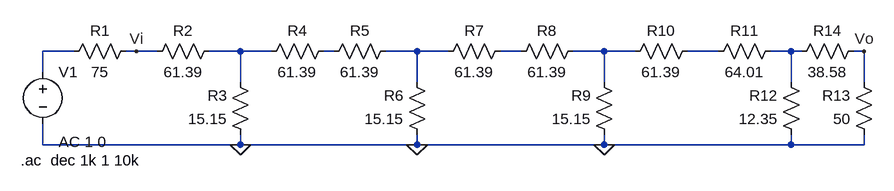
[diagram p0: schematic Circuito_P2d.asc]
Circuito_P2d.asc, the LTspice schematic file:
Version 4
SHEET 1 1264 680
WIRE 16 80 -32 80
WIRE 112 80 96 80
WIRE 144 80 112 80
WIRE 272 80 224 80
WIRE 320 80 272 80
WIRE 416 80 400 80
WIRE 544 80 496 80
WIRE 592 80 544 80
WIRE 704 80 672 80
WIRE 832 80 784 80
WIRE 880 80 832 80
WIRE 1008 80 960 80
WIRE 1120 80 1088 80
WIRE 1136 80 1120 80
WIRE 1232 80 1216 80
WIRE -32 112 -32 80
WIRE 272 128 272 80
WIRE 544 128 544 80
WIRE 832 128 832 80
WIRE 1120 128 1120 80
WIRE 1232 128 1232 80
WIRE -32 224 -32 192
WIRE 272 224 272 208
WIRE 272 224 -32 224
WIRE 544 224 544 208
WIRE 544 224 272 224
WIRE 832 224 832 208
WIRE 832 224 544 224
WIRE 1120 224 1120 208
WIRE 1120 224 832 224
WIRE 1232 224 1232 208
WIRE 1232 224 1120 224
FLAG 272 224 0
FLAG 544 224 0
FLAG 832 224 0
FLAG 112 80 Vi
FLAG 1232 80 Vo
SYMBOL voltage -32 96 R0
WINDOW 123 24 124 Left 2
WINDOW 39 0 0 Left 0
SYMATTR InstName V1
SYMATTR Value ""
SYMATTR Value2 AC 1 0
SYMBOL res 112 64 R90
WINDOW 0 0 56 VBottom 2
WINDOW 3 32 56 VTop 2
SYMATTR InstName R1
SYMATTR Value 75
SYMBOL res 240 64 R90
WINDOW 0 0 56 VBottom 2
WINDOW 3 32 56 VTop 2
SYMATTR InstName R2
SYMATTR Value 61.39
SYMBOL res 288 224 R180
WINDOW 0 36 76 Left 2
WINDOW 3 36 40 Left 2
SYMATTR InstName R3
SYMATTR Value 15.15
SYMBOL res 304 96 R270
WINDOW 0 32 56 VTop 2
WINDOW 3 0 56 VBottom 2
SYMATTR InstName R4
SYMATTR Value 61.39
SYMBOL res 512 64 R90
WINDOW 0 0 56 VBottom 2
WINDOW 3 32 56 VTop 2
SYMATTR InstName R5
SYMATTR Value 61.39
SYMBOL res 560 224 R180
WINDOW 0 36 76 Left 2
WINDOW 3 36 40 Left 2
SYMATTR InstName R6
SYMATTR Value 15.15
SYMBOL res 576 96 R270
WINDOW 0 32 56 VTop 2
WINDOW 3 0 56 VBottom 2
SYMATTR InstName R7
SYMATTR Value 61.39
SYMBOL res 800 64 R90
WINDOW 0 0 56 VBottom 2
WINDOW 3 32 56 VTop 2
SYMATTR InstName R8
SYMATTR Value 61.39
SYMBOL res 848 224 R180
WINDOW 0 36 76 Left 2
WINDOW 3 36 40 Left 2
SYMATTR InstName R9
SYMATTR Value 15.15
SYMBOL res 864 96 R270
WINDOW 0 32 56 VTop 2
WINDOW 3 0 56 VBottom 2
SYMATTR InstName R10
SYMATTR Value 61.39
SYMBOL res 1104 64 R90
WINDOW 0 0 56 VBottom 2
WINDOW 3 32 56 VTop 2
SYMATTR InstName R11
SYMATTR Value 64.01
SYMBOL res 1136 224 R180
WINDOW 0 36 76 Left 2
WINDOW 3 36 40 Left 2
SYMATTR InstName R12
SYMATTR Value 12.35
SYMBOL res 1248 224 R180
WINDOW 0 36 76 Left 2
WINDOW 3 36 40 Left 2
SYMATTR InstName R13
SYMATTR Value 50
SYMBOL res 1232 64 R90
WINDOW 0 0 56 VBottom 2
WINDOW 3 32 56 VTop 2
SYMATTR InstName R14
SYMATTR Value 38.58
TEXT -66 248 Left 2 !.ac  dec 1k 1 10k

The netlist it stands for:
* Circuito_P2d.asc
V1 N001 0 AC 1 0
R1 Vi N001 75
R2 N002 Vi 61.39
R3 0 N002 15.15
R4 N002 N003 61.39
R5 N004 N003 61.39
R6 0 N004 15.15
R7 N004 N005 61.39
R8 N006 N005 61.39
R9 0 N006 15.15
R10 N006 N007 61.39
R11 N008 N007 64.01
R12 0 N008 12.35
R13 0 Vo 50
R14 Vo N008 38.58
.ac  dec 1k 1 10k
.backanno
.end